# Altium schematic sheet PSU_1084SET_2V5.SchDoc: PSU AP1084KL SET TO 2V5
size A4; Organization: Altium Limited.; Address1: Level 3, 12a Rodborough Rd; Address2: Frenchs Forest 2086; Address3: NSW; Address4: AUSTRALIA; DocumentNumber: 37; SheetNumber: 38; SheetTotal: 77
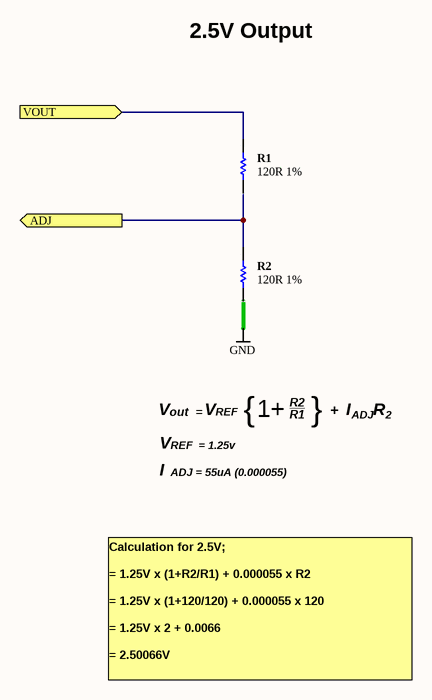
[diagram p0: PSU_1084SET_2V5.SchDoc]

## Parts
R1  120R 1%  [RESC1005-STAR]
R2  120R 1%  [RESC1005-STAR]

## Ports
ADJ (out), VOUT (in)

## Nets
GND: R2.2
ADJ: R1.1 R2.1 ; port ADJ
VOUT: R1.2 ; port VOUT

## Notes on the sheet
- 2.5V Output
- V
- out  =
- REF  = 1.25v
- REF
- {
- 1+
- R2
- R1
- }
- +
- I
- ADJ
- R
- 2
- ADJ = 55uA (0.000055)
- Calculation for 2.5V;
  = 1.25V x (1+R2/R1) + 0.000055 x R2
  = 1.25V x (1+120/120) + 0.000055 x 120
  = 1.25V x 2 + 0.0066
  = 2.50066V
- Sheet Title
- Project Title
- Size:
- Date:
- A4
- Assy:
- Time:
- Revision:
- Sheet
- of
- File:

## Library data of the parts
R1 R2 = D-100-0126: Resistor, 120R 1% 0402 (1005); Power Rating: 63 mW; Category: Resistor; Mounting Technology: Surface Mount; Resistance: 120 R; Status: Production; Tolerance: 1 %